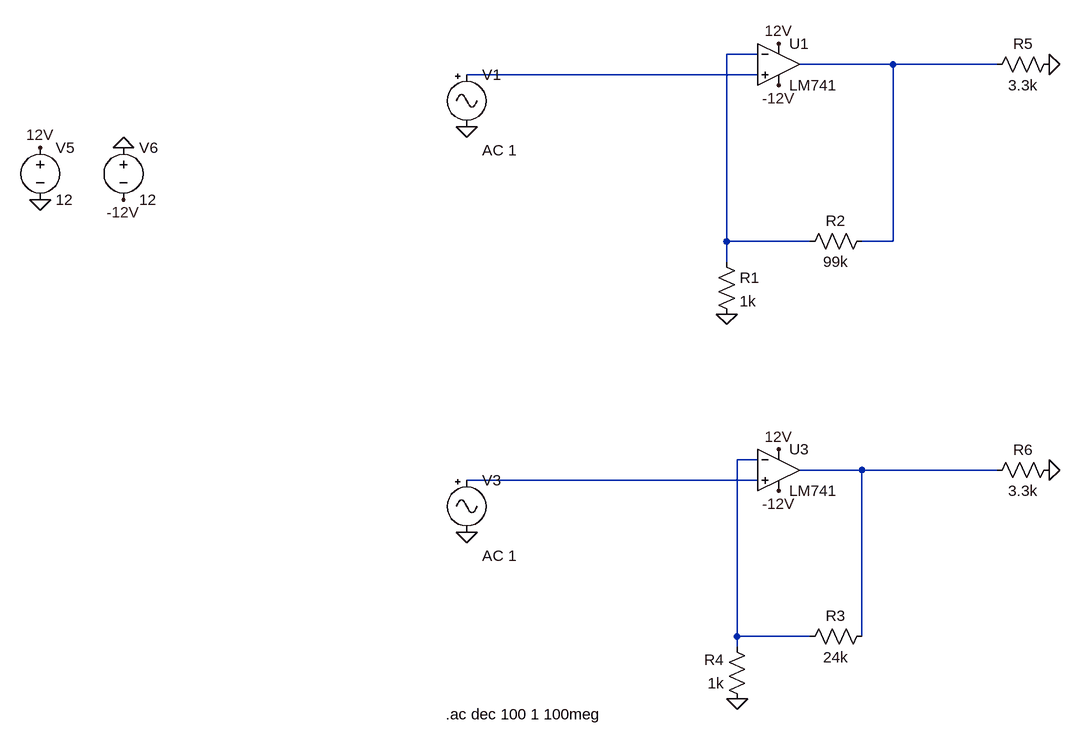
[diagram p0: schematic Draft2.asc]
Draft2.asc, the LTspice schematic file:
Version 4
SHEET 1 980 1128
WIRE 432 96 384 96
WIRE 640 112 496 112
WIRE 800 112 640 112
WIRE 432 128 -16 128
WIRE 384 384 384 96
WIRE 512 384 384 384
WIRE 640 384 640 112
WIRE 640 384 592 384
WIRE 384 416 384 384
WIRE 432 720 400 720
WIRE 592 736 496 736
WIRE 800 736 592 736
WIRE 432 752 -16 752
WIRE 400 992 400 720
WIRE 512 992 400 992
WIRE 592 992 592 736
WIRE 400 1008 400 992
FLAG -16 208 0
FLAG 384 496 0
FLAG -16 832 0
FLAG 400 1088 0
FLAG 880 112 0
FLAG 880 736 0
FLAG -672 320 0
FLAG -544 240 0
FLAG -672 240 12V
FLAG -544 320 -12V
FLAG 464 144 -12V
FLAG 464 768 -12V
FLAG 464 80 12V
FLAG 464 704 12V
SYMBOL Misc\\signal -16 112 R0
WINDOW 123 24 132 Left 2
WINDOW 39 0 0 Left 0
SYMATTR Value2 AC 1
SYMATTR InstName V1
SYMATTR Value ""
SYMBOL res 368 400 R0
SYMATTR InstName R1
SYMATTR Value 1k
SYMBOL res 608 368 R90
WINDOW 0 0 56 VBottom 2
WINDOW 3 32 56 VTop 2
SYMATTR InstName R2
SYMATTR Value 99k
SYMBOL LM741 464 48 R0
SYMATTR InstName U1
SYMBOL LM741 464 672 R0
SYMATTR InstName U3
SYMBOL res 608 976 R90
WINDOW 0 0 56 VBottom 2
WINDOW 3 32 56 VTop 2
SYMATTR InstName R3
SYMATTR Value 24k
SYMBOL res 416 1104 R180
WINDOW 0 36 76 Left 2
WINDOW 3 36 40 Left 2
SYMATTR InstName R4
SYMATTR Value 1k
SYMBOL Misc\\signal -16 736 R0
WINDOW 123 24 132 Left 2
WINDOW 39 0 0 Left 0
SYMATTR Value2 AC 1
SYMATTR InstName V3
SYMATTR Value ""
SYMBOL res 896 96 R90
WINDOW 0 0 56 VBottom 2
WINDOW 3 32 56 VTop 2
SYMATTR InstName R5
SYMATTR Value 3.3k
SYMBOL res 896 720 R90
WINDOW 0 0 56 VBottom 2
WINDOW 3 32 56 VTop 2
SYMATTR InstName R6
SYMATTR Value 3.3k
SYMBOL voltage -672 224 R0
WINDOW 123 0 0 Left 0
WINDOW 39 0 0 Left 0
SYMATTR InstName V5
SYMATTR Value 12
SYMBOL voltage -544 224 R0
WINDOW 123 0 0 Left 0
WINDOW 39 0 0 Left 0
SYMATTR InstName V6
SYMATTR Value 12
TEXT -48 1112 Left 2 !.ac dec 100 1 100meg

The netlist it stands for:
* Draft2.asc
V1 N003 0 AC 1
R1 N001 0 1k
R2 N002 N001 99k
XU1 N003 N001 12V -12V N002 LM741  ; pins In+ In- V+ V- OUT
XU3 N006 N004 12V -12V N005 LM741  ; pins In+ In- V+ V- OUT
R3 N005 N004 24k
R4 0 N004 1k
V3 N006 0 AC 1
R5 0 N002 3.3k
R6 0 N005 3.3k
V5 12V 0 12
V6 0 -12V 12
.ac dec 100 1 100meg
.lib LM741.lib
.backanno
.end